# EasyEDA Pro project ProPrj_Piano_scan_for_conserts3_2026-02-26.epro, board reuse_base
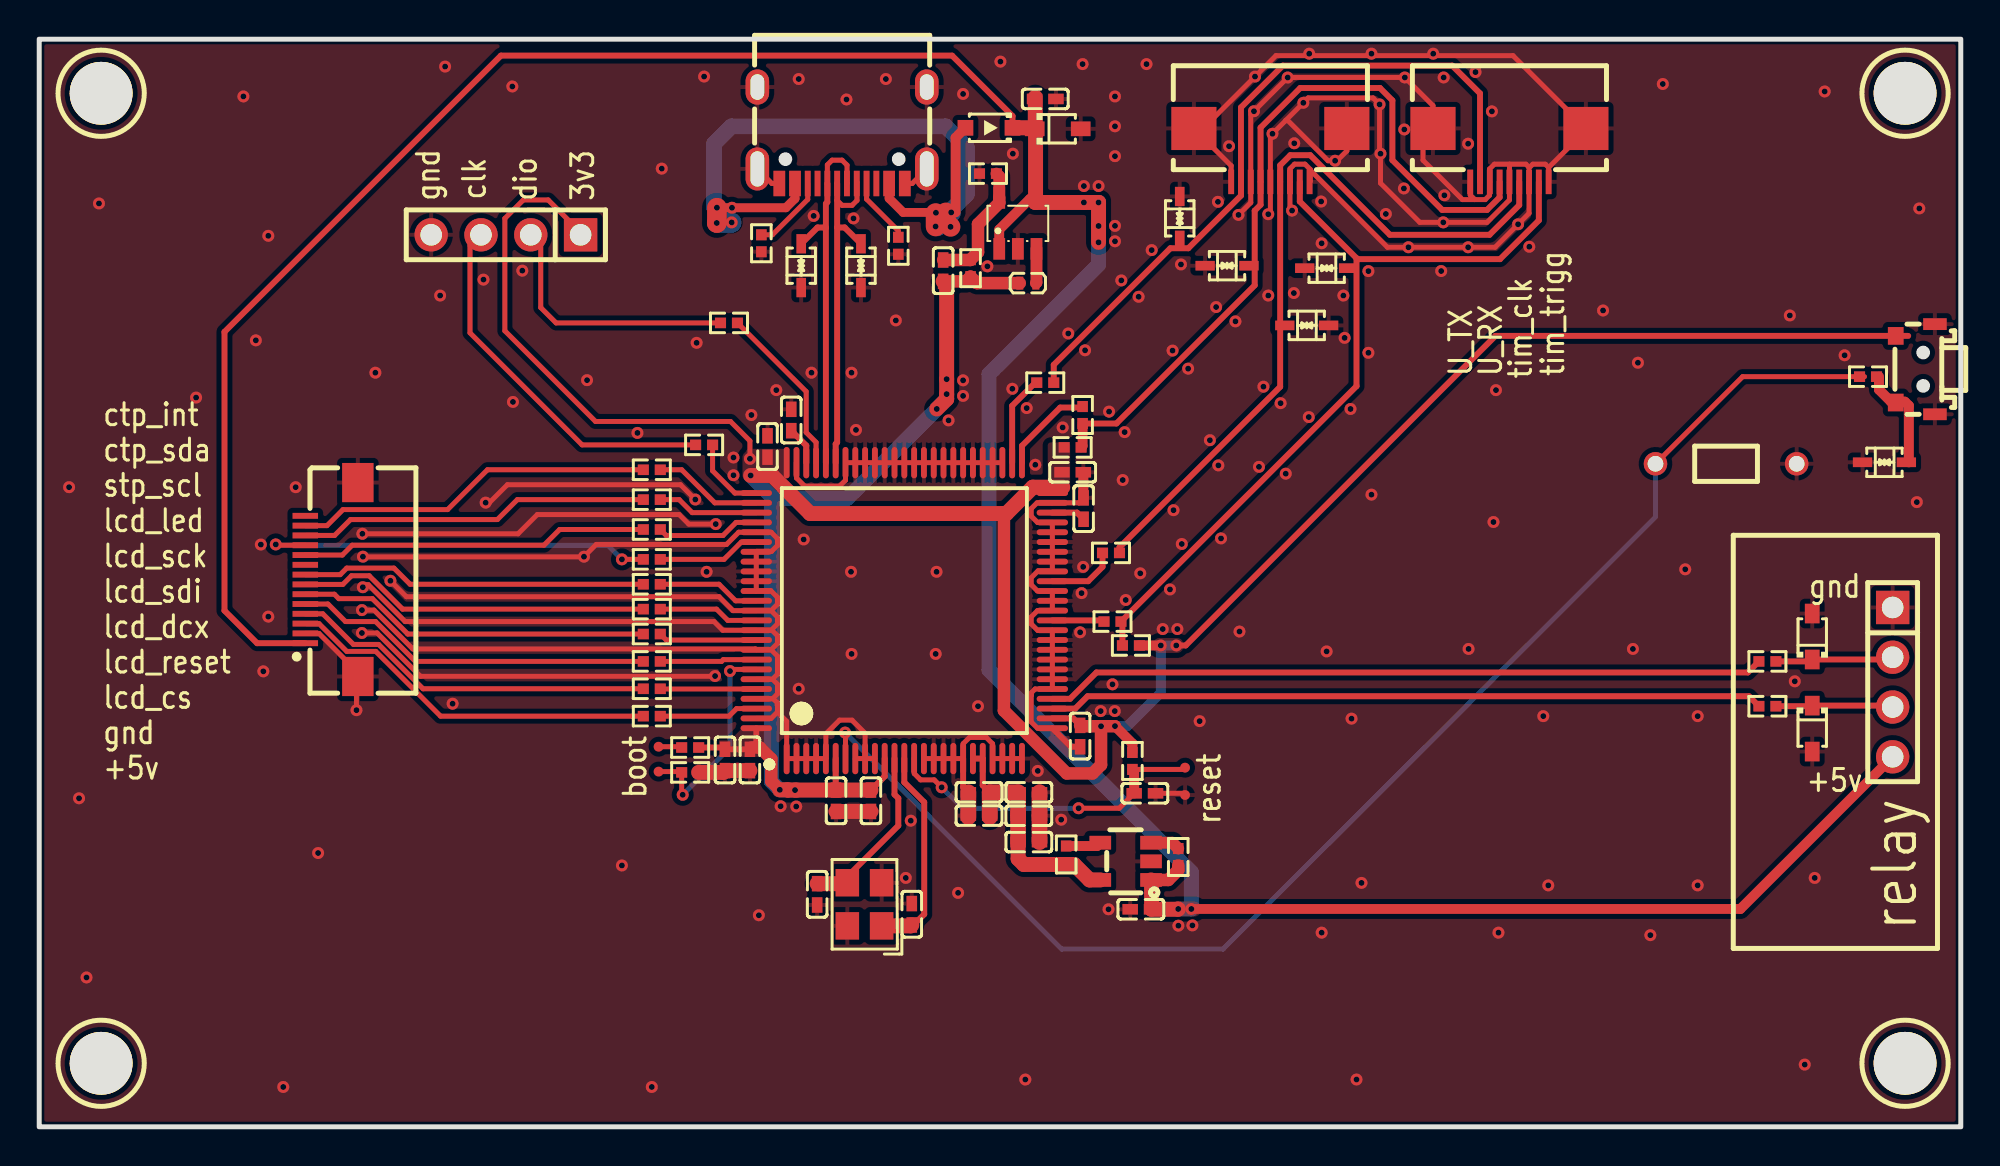
[diagram p8: board, top side]
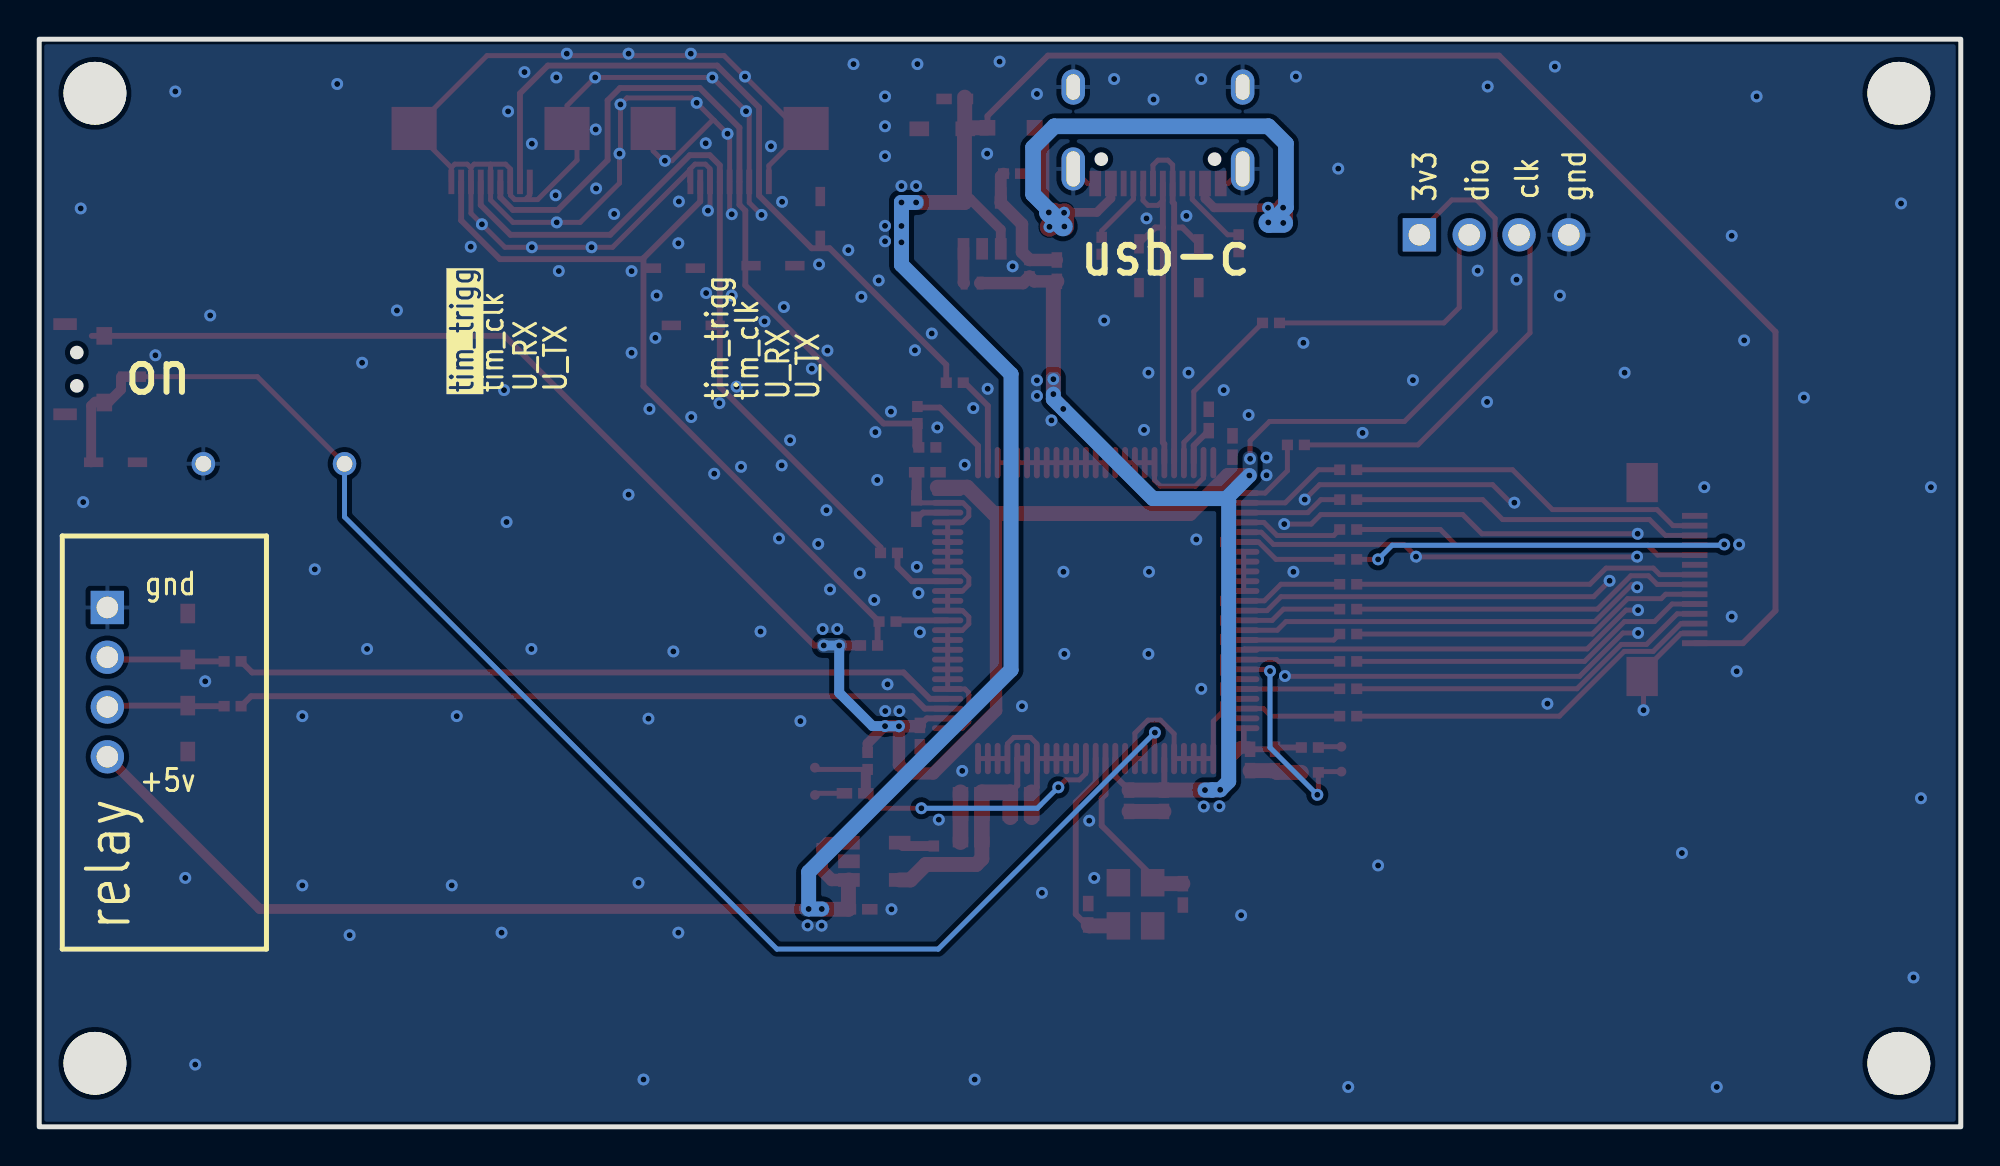
[diagram p9: board, bottom side, seen from below]

Outline 98 x 55.5 mm; copper layers: Top Layer, Bottom Layer. Coordinates in mm from the lower left corner of the outline.
Outline path: rectangle 0,55.5 98,0
Stack: Top Layer 0.035mm / Dielectric1 1.51mm FR4 er 4.5 / Bottom Layer 0.035mm

## Design rules (mm)
template: JLCPCB Capability(Two Layers Board)
spacing copperThickness1oz (default): track to track 0.102, other pairs 0.152 to 0.3
spacing copperThickness2oz: track to track 0.203, other pairs 0.152 to 0.3
track width copperThickness1oz (default): min 0.127, default 0.254, max 2.54
track width copperThickness2oz: min 0.203, default 0.254, max 2.54
differential pair differentialPair (default): width min 0.127, default 0.254, max 2.54; gap min 0.152, default 0.152
via viaSize (default): diameter min 0.5, default 0.61, max 10; hole min 0.3, default 0.305, max 6.3

## Placement (name value [footprint] x y rotation side)
C1  22pF  [C0402]  46.1 43.69 270 top
C2  1uF  [C0402]  56.19 11.1 180 top
C3  1uF  [C0402]  50.47 14.53 0 top
C4  10pF  [C0402]  39.68 11.86 90 top
C5  10pF  [C0402]  44.5 10.85 90 top
C6  100nF  [C0402]  40.64 16.64 90 top
C7  4.7uF  [C0402]  51.31 52.45 180 top
C8  1uF  [C0402]  50.47 17.07 0 top
C9  100nF  [C0402]  47.93 15.88 180 top
C10  1uF  [C0402]  50.47 15.87 0 top
C11  100nF  [C0402]  47.93 17.07 180 top
C12  2.2uF  [C0402]  38.35 36.07 270 top
C13  100nF  [C0402]  56.39 17.02 0 top
C14  2.2uF  [C0402]  53.26 31.55 90 top
C15  100nF  [C0402]  42.42 16.64 270 top
C16  100nF  [C0402]  36.25 18.72 270 top
C17  100nF  [C0402]  53.09 19.94 270 top
C18  100nF  [C0402]  52.7 33.4 0 top
C19  100nF  [C0402]  37.14 34.72 90 top
C20  10uF  [C0402]  34.98 18.72 270 top
D1  CDSOD323-T03C  [SOD-323_L1.8-W1.3-LS2.5-BI]  64.64 40.89 0 top
D2  CDSOD323-T03C  [SOD-323_L1.8-W1.3-LS2.5-BI]  60.58 43.94 180 top
D3  CDSOD323-T03C  [SOD-323_L1.8-W1.3-LS2.5-BI]  65.66 43.81 180 top
D4  CDSOD323-T03C  [SOD-323_L1.8-W1.3-LS2.5-BI]  58.17 46.36 90 top
D5  LESD3Z5.0T1G  [SOD-323_L1.8-W1.3-LS2.5-RD]  51.94 50.93 0 top
D6  B5819WS  [SOD-323_L1.7-W1.3-LS2.5-RD]  48.44 50.98 180 top
D7  LESD3Z5.0T1G  [SOD-323_L1.8-W1.3-LS2.5-RD]  90.42 25.02 90 top
D8  LESD3Z5.0T1G  [SOD-323_L1.8-W1.3-LS2.5-RD]  90.42 20.32 270 top
D9  CDSOD323-T05C  [SOD-323_L1.8-W1.3-LS2.5-BI]  41.91 43.94 270 top
D10  CDSOD323-T05C  [SOD-323_L1.8-W1.3-LS2.5-BI]  38.86 43.94 270 top
D11  CDSOD323-T03C  [SOD-323_L1.8-W1.3-LS2.5-BI]  94.11 33.91 0 top
H2  debug  [HDR-TH_4P-P2.54-V-M]  23.8 45.52 180 top
H3  relay  [HDR-TH_4P-P2.54-V-M]  94.53 22.69 270 top
L1  2.2uH  [IND-SMD_L1.2-W0.7]  50.42 43.05 180 top
R1  680kΩ  [R0402]  47.5 43.81 270 top
R2  150kΩ  [R0402]  48.39 48.64 0 top
R3  10kΩ  [R0402]  58.09 13.77 270 top
R4  100kΩ  [R0402]  52.38 13.89 270 top
R5  100Ω  [R0402]  31.24 20.95 180 top
R6  100Ω  [R0402]  31.24 22.35 180 top
R7  100Ω  [R0402]  31.24 23.75 180 top
R8  100Ω  [R0402]  31.24 25.15 180 top
R9  100Ω  [R0402]  31.24 26.42 180 top
R10  100Ω  [R0402]  31.24 27.69 180 top
R11  33Ω  [R0402]  35.18 41.02 180 top
R12  33Ω  [R0402]  33.91 34.8 180 top
R13  100Ω  [R0402]  31.24 28.96 180 top
R14  100Ω  [R0402]  31.24 30.48 180 top
R15  100Ω  [R0402]  31.24 32 180 top
R16  100Ω  [R0402]  31.24 33.53 180 top
R17  330Ω  [R0402]  33.2 19.36 180 top
R18  10kΩ  [R0402]  55.75 18.67 270 top
R19  10kΩ  [R0402]  33.2 18.09 180 top
R20  1kΩ  [R0402]  55.68 24.56 180 top
R21  5.1kΩ  [R0402]  43.81 44.96 90 top
R22  62Ω  [R0402]  54.74 25.78 180 top
R23  100Ω  [R0402]  54.66 29.29 180 top
R24  100Ω  [R0402]  88.14 23.75 180 top
R25  100Ω  [R0402]  88.14 21.46 180 top
R26  100Ω  [R0402]  51.31 37.97 0 top
R27  5.1kΩ  [R0402]  53.21 36.32 270 top
R28  62Ω  [R0402]  36.83 45.09 90 top
R29  1kΩ  [R0402]  52.71 34.67 0 top
R30  330Ω  [R0402]  93.27 38.28 180 top
R31  10kΩ  [RES-TH_BD1.8-L3.2-P7.20-D0.4]  86.03 33.83 180 top
SCREW1  -  [Screw-Hole-M3]  95.22 52.68 0 top
SCREW2  -  [Screw-Hole-M3]  3.22 3.18 0 top
SCREW3  -  [Screw-Hole-M3]  95.22 3.18 0 top
SCREW4  -  [Screw-Hole-M3]  3.22 52.68 0 top
SW1  1TS003BBB-2000-3503B-CT  [KEY-SMD_1TS003B]  95.68 38.66 90 top
TP1  -  [Test-Point-0.5mm]  31.59 19.4 180 top
TP2  -  [Test-Point-0.5mm]  58.44 18.33 90 top
TP3  -  [Test-Point-0.5mm]  31.59 18.13 180 top
TP4  -  [Test-Point-0.5mm]  58.44 16.93 90 top
U1  AFD01-S09FCA-00  [FPC-SMD_9P-P0.50_JS_AFD01-S09FCA-00]  62.79 49.58 0 top
U2  AFD01-S09FCA-00  [FPC-SMD_9P-P0.50_JS_AFD01-S09FCA-00]  74.98 49.58 0 top
U3  AFC01-S14FCA-00  [SOT-23-5_L3.0-W1.7-P0.95-LS2.8-BR]  49.91 46.1 270 top
U4  SY8088AAC  [TSOT-23-5_L2.9-W1.6-P0.95-LS2.8-BR]  55.41 13.55 0 top
U5  LDLN030G33R  [LQFP-100_L14.0-W14.0-P0.50-LS16.0-BL]  44.12 26.34 0 top
U6  STM32H723VGT6  [CRYSTAL-SMD_4P-L3.2-W2.5-BL-1]  42.09 11.35 90 top
USB1  U262-161N-4BVC11  [USB-3.1-SMD_U262-161N-4BVC11]  40.94 50.6 180 top
X1  AFC01-S14FCA-00  [FPC-SMD_AFC01-S14FCA-00]  14.91 27.93 90 top

## Footprints (pads in the part's own frame, mm; a bottom-side part is the same pattern mirrored in y, then rotated)
C0402
  rect 0.79x0.54 smd: 1(-0.545,0) 2(0.545,0)
CRYSTAL-SMD_4P-L3.2-W2.5-BL-1
  rect 1.4x1.2 smd: 1(-1.1,-0.875) 2(1.1,-0.875) 3(1.1,0.875) 4(-1.1,0.875)
FPC-SMD_9P-P0.50_JS_AFD01-S09FCA-00
  rect 0.3x1.25 smd: 1(-2,-1.363) 2(-1.5,-1.363) 3(-1,-1.363) 4(-0.5,-1.363) 5(0,-1.363) 6(0.499,-1.363) 7(1,-1.363) 8(1.5,-1.363) 9(2,-1.363)
  rect 2.3x2.2 smd: 10(3.9,1.363) 11(-3.9,1.363)
FPC-SMD_AFC01-S14FCA-00
  rect 0.3x1.3 smd: 1(-3.25,1.34) 2(-2.75,1.339) 3(-2.25,1.34) 4(-1.75,1.34) 5(-1.25,1.34) 6(-0.75,1.34) 7(-0.25,1.34) 8(0.25,1.34) 9(0.75,1.34) 10(1.25,1.34) 11(1.75,1.34) 12(2.25,1.34) 13(2.75,1.34) 14(3.25,1.34)
  rect 2x1.6 smd: 15(4.948,-1.34) 16(-4.948,-1.34)
HDR-TH_4P-P2.54-V-M
  rect 1.7x1.7 hole 1.1: 1(-3.81,0)
  round 1.7 hole 1.1: 2(-1.27,0) 3(1.27,0) 4(3.81,0)
IND-SMD_L1.2-W0.7
  rect 0.36x0.66 smd: 1(-0.41,0) 2(0.41,0)
KEY-SMD_1TS003B
  rect 0.9x0.8 smd: 1(1.7,1) 2(-1.7,1)
  rect 0.6x1.2 smd: 3(-2.3,-1) 4(2.3,-1)
LQFP-100_L14.0-W14.0-P0.50-LS16.0-BL
  oval 0.3x1.6 smd: 1(-6,-7.55) 2(-5.5,-7.55) 3(-5,-7.55) 4(-4.5,-7.55) 5(-4,-7.55) 6(-3.5,-7.55) 7(-3,-7.55) 8(-2.5,-7.55) 9(-2,-7.55) 10(-1.5,-7.55) 11(-1,-7.55) 12(-0.5,-7.55) 13(0,-7.55) 14(0.5,-7.55) 15(1,-7.55) 16(1.5,-7.55) 17(2,-7.55) 18(2.5,-7.55) 19(3,-7.55) 20(3.5,-7.55) 21(4,-7.55) 22(4.5,-7.55) 23(5,-7.55) 24(5.5,-7.55) 25(6,-7.55) 51(6,7.55) 52(5.5,7.55) 53(5,7.55) 54(4.5,7.55) 55(4,7.55) 56(3.5,7.55) 57(3,7.55) 58(2.5,7.55) 59(2,7.55) 60(1.5,7.55) 61(1,7.55) 62(0.5,7.55) 63(0,7.55) 64(-0.5,7.55) 65(-1,7.55) 66(-1.5,7.55) 67(-2,7.55) 68(-2.5,7.55) 69(-3,7.55) 70(-3.5,7.55) 71(-4,7.55) 72(-4.5,7.55) 73(-5,7.55) 74(-5.5,7.55) 75(-6,7.55)
  oval 1.6x0.3 smd: 26(7.55,-6) 27(7.55,-5.5) 28(7.55,-5) 29(7.55,-4.5) 30(7.55,-4) 31(7.55,-3.5) 32(7.55,-3) 33(7.55,-2.5) 34(7.55,-2) 35(7.55,-1.5) 36(7.55,-1) 37(7.55,-0.5) 38(7.55,0) 39(7.55,0.5) 40(7.55,1) 41(7.55,1.5) 42(7.55,2) 43(7.55,2.5) 44(7.55,3) 45(7.55,3.5) 46(7.55,4) 47(7.55,4.5) 48(7.55,5) 49(7.55,5.5) 50(7.55,6) 76(-7.55,6) 77(-7.55,5.5) 78(-7.55,5) 79(-7.55,4.5) 80(-7.55,4) 81(-7.55,3.5) 82(-7.55,3) 83(-7.55,2.5) 84(-7.55,2) 85(-7.55,1.5) 86(-7.55,1) 87(-7.55,0.5) 88(-7.55,0) 89(-7.55,-0.5) 90(-7.55,-1) 91(-7.55,-1.5) 92(-7.55,-2) 93(-7.55,-2.5) 94(-7.55,-3) 95(-7.55,-3.5) 96(-7.55,-4) 97(-7.55,-4.5) 98(-7.55,-5) 99(-7.55,-5.5) 100(-7.55,-6)
R0402
  rect 0.566x0.54 smd: 1(-0.433,0) 2(0.433,0)
RES-TH_BD1.8-L3.2-P7.20-D0.4
  round 1.2 hole 0.8: 1(-3.6,0) 2(3.6,0)
Screw-Hole-M3
  round 3.2 hole 3.2: 1(-0.064,0.064)
SOD-323_L1.7-W1.3-LS2.5-RD
  rect 0.8x0.8 smd: 1(-1.2,0) 2(1.2,0)
SOD-323_L1.8-W1.3-LS2.5-BI
  rect 0.985x0.49 smd: 1(-1.117,0) 2(1.117,0)
SOD-323_L1.8-W1.3-LS2.5-RD
  rect 1x0.75 smd: 1(-1.173,0) 2(1.173,0)
SOT-23-5_L3.0-W1.7-P0.95-LS2.8-BR
  rect 1.1x0.6 smd: 1(1.3,-0.95) 2(1.3,0) 3(1.3,0.95) 4(-1.3,0.95) 5(-1.3,-0.95)
Test-Point-0.5mm
  round 0.5 smd: 1(0,0)
TSOT-23-5_L2.9-W1.6-P0.95-LS2.8-BR
  rect 1.1x0.7 smd: 1(1.294,-0.951) 2(1.294,-0.001) 3(1.294,0.951) 4(-1.294,0.951) 5(-1.294,-0.949)
USB-3.1-SMD_U262-161N-4BVC11
  oval 1.2x2.2 hole 0.7x1.8: 13(4.32,1.719) 16(-4.32,1.719)
  oval 1.2x1.8 hole 0.7x1.3: 14(4.32,-2.462) 15(-4.32,-2.462)
  rect 0.6x1.3 smd: A1B12(-3.2,2.462) A4B9(-2.4,2.462) B1A12(3.2,2.462) B4A9(2.4,2.462)
  rect 0.3x1.3 smd: A5(-1.25,2.462) A6(-0.25,2.462) A7(0.25,2.462) A8(1.25,2.462) B5(1.75,2.462) B6(0.75,2.462) B7(-0.75,2.462) B8(-1.75,2.462)

## Nets
+3V3: C1.2 C6.2 C15.1 C16.1 C17.1 C18.1 C19.1 C20.1 H2.1 L1.2 R1.2 R17.1 R18.1 R20.1 R29.1 SW1.1 U5.6 U5.11 U5.27 U5.50 U5.75 U5.100
+5V: C2.1 C7.2 D5.1 D6.1 H3.4 R3.2 U3.1 U3.4 U4.1 X1.1
GND: C2.2 C3.2 C4.1 C5.2 C6.1 C7.1 C8.2 C9.2 C10.2 C11.2 C12.1 C13.2 C14.2 C15.2 C16.2 C17.2 C18.2 C19.2 C20.2 D1.2 D2.2 D3.2 D4.2 D5.2 D7.2 D8.2 D9.2 D10.2 D11.1 H2.4 H3.1 R2.1 R19.1 R21.1 R28.1 R31.1 SW1.3 SW1.4 TP4.1 U1.1 U1.3 U1.5 U1.7 U1.9 U1.10 U1.11 U2.1 U2.3 U2.5 U2.7 U2.9 U2.10 U2.11 U3.2 U4.2 U5.1 U5.2 U5.3 U5.4 U5.5 U5.8 U5.9 U5.10 U5.15 U5.16 U5.17 U5.18 U5.19 U5.22 U5.23 U5.24 U5.25 U5.26 U5.30 U5.31 U5.32 U5.33 U5.34 U5.35 U5.36 U5.38 U5.39 U5.40 U5.42 U5.43 U5.44 U5.45 U5.46 U5.47 U5.49 U5.53 U5.54 U5.55 U5.56 U5.57 U5.58 U5.59 U5.60 U5.61 U5.62 U5.63 U5.64 U5.65 U5.66 U5.67 U5.68 U5.69 U5.74 U5.80 U5.82 U5.83 U5.84 U5.85 U5.86 U5.88 U5.90 U5.92 U5.95 U5.97 U5.99 U6.2 U6.4 USB1.13 USB1.14 USB1.15 USB1.16 USB1.A1B12 USB1.B1A12 X1.2 X1.15 X1.16
VBUS: D6.2 USB1.A4B9 USB1.B4A9
VDDA: C3.1 C8.1 C9.1 C10.1 C11.1 R4.2 U4.5 U5.20 U5.21
BOOT0: R19.2 TP3.1 U5.94
CTP_INT: R16.2 X1.13
CTP_RST: R13.2 X1.11
CTP_SCL: R14.2 X1.10
CTP_SDA: R15.2 X1.12
LCD_CS: R5.2 X1.3
LCD_DCX: R7.2 X1.5
LCD_LED: R10.2 X1.8
LCD_RESET: R6.2 X1.4
LCD_SCK: R9.2 X1.7
LCD_SDI: R8.2 X1.6
RCC_OSC_IN: C4.2 U5.12 U6.3
RCC_OSC_OUT: C5.1 U5.13 U6.1
RELAY_1: R25.2 U5.28
RELAY_2: R24.2 U5.29
RESET: C13.1 R18.2 TP2.1 U5.14
SYS_ITCK-SWCLK: R12.1 U5.76
SYS_ITMS-SWDIO: R11.1 U5.72
TIM_CLK: D1.1 R23.1 U1.6 U2.6
TIM_TRIGG: D3.1 R20.2 R22.1 U1.8 U2.8
U_RX: D2.1 R27.2 R29.2 U1.4 U2.4
U_TX: D4.1 R26.2 U1.2 U2.2
USB_DN: D9.1 U5.70 USB1.A7 USB1.B7
USB_DP: D10.1 U5.71 USB1.A6 USB1.B6
WAKEUP: R30.2 R31.2 U5.7
$1N5495: R4.1 U4.4
$1N5501: R3.1 U4.3
$1N5509: C14.1 U5.48
$1N5515: C12.2 U5.73
$1N5531: R22.2 U5.37
$1N5532: D8.1 H3.3 R25.1
$1N5535: D7.1 H3.2 R24.1
$1N5542: D11.2 R30.1 SW1.2
$1N5554: H2.3 R12.2
$1N5555: H2.2 R11.2
$1N5563: R17.2 TP1.1
$1N5587: R28.2 USB1.B5
$1N5590: R21.2 USB1.A5
$1N5866: R23.2 U5.41
$1N5914: R27.1 U5.51
$1N6033: R26.1 U5.52
$1N6271: R5.1 U5.98
$1N6331: R6.1 U5.96
$1N6370: R7.1 U5.93
$1N6416: R8.1 U5.91
$1N6457: R9.1 U5.89
$1N6507: R10.1 U5.87
$1N6551: R13.1 U5.81
$1N6676: R14.1 U5.79
$1N6680: R15.1 U5.78
$1N6685: R16.1 U5.77
$1N6938: L1.1 U3.3
$1N7163: C1.1 R1.1 R2.2 U3.5

Pads without a net: SCREW1 1; SCREW2 1; SCREW3 1; SCREW4 1; USB1 A8 B8; X1 9 14

## Via types
v1: diameter 0.61, hole 0.305, Top Layer to Bottom Layer, 231 vias

## Routing (per net, layer and track width the routed paths; a pad name or vN(x,y) marks a point on that pad's centre or on a via; arc(x,y) is an arc through that point)
+3V3: length 174
  Top Layer w0.254: v1(36.25,34.09) 36.25,35 35.25,35.99 28.37,35.99 23.75,40.62 23.75,46.36 24.69,47.3 25.96,47.3 27.61,45.64 H2.1
  Top Layer w0.299: 95.32,40.36 74.27,40.36 58.47,24.56 v1(57.99,24.56)
  Top Layer w0.3: U5.100 36.57,19.59 36.34,19.36 ; C16.1 C20.1 34.89,19.36 R17.1
  Top Layer w0.305: C17.1 52.73,20.84 U5.27 ; C15.1 43.12,17.89 43.12,18.79 ; 40.62,17.2 40.62,18.79
  Top Layer w0.508: R18.1 55.75,19.56 v1(54.86,20.45) ; v1(57.2,24.56) R20.1 ; 36.34,19.36 C16.1
  Top Layer w0.635: C17.1 53.13,20.44 v1(54.15,20.44) ; 49.14,31.29 49.14,31.17 49.2,31.11 49.2,21.24 52.4,18.03 53.72,18.03 54.15,18.47 v1(54.15,20.44) ; L1.2 47.83,43.05 R1.2 47.26,43.14 C1.2 ; v1(37.77,17.2) 37.34,17.63 37.34,18.77 36.75,19.36 36.34,19.36 ; v1(54.15,20.44) 54.86,20.44 ; 38.66,17.2 38.65,17.18
  Top Layer w0.762: C15.1 C6.2 v1(38.55,17.18) 38.18,17.18 38.17,17.2 v1(37.77,17.2) ; v1(45.78,36.63) 46.28,37.14 v1(46.28,37.39) v1(46.28,38.15) 46.28,42.97 C1.2 ; 52.2,32.64 50.67,32.64 49.33,31.29 39.32,31.29 37.38,33.24 v1(36.28,33.24)
  Bottom Layer w0.508: v1(54.15,20.44) 54.86,20.44 v1(54.86,20.45) 55.5,20.45 57.2,22.15 v1(57.2,24.56) v1(57.99,24.56)
  Bottom Layer w0.762: v1(46.28,37.39) 46.28,37.14 v1(45.78,36.63) 41.2,32.06 37.46,32.06 ; v1(36.28,33.24) 37.46,32.06 ; 37.46,32.06 37.34,31.93 37.34,17.63 v1(37.77,17.2) 38.17,17.2 38.18,17.18 v1(38.55,17.18)
+5V: length 170.1
  Top Layer w0.3: X1.1 11.11,24.68 9.45,26.34 9.45,40.56 23.55,54.66 46.56,54.66 49.64,51.58 D6.1
  Top Layer w0.5: H3.4 86.76,11.12 v1(58.76,11.12) ; U3.1 48.96,45.79 50.53,47.35 50.81,47.35
  Top Layer w0.635: 58.09,13.33 58.09,13.1 57.58,12.6 U4.1
  Top Layer w0.762: U4.1 56.73,12.57 C2.1 58.07,11.1 v1(58.09,11.12) ; 50.8,50.98 50.8,52.54 ; 50.8,50.98 50.8,50.96 D5.1 ; 50.8,50.98 D6.1 ; 50.8,50.98 50.81,50.98 50.81,47.22 50.79,47.19 50.81,47.17 v1(53.28,47.17) v1(54.03,47.17) v1(54.03,45.97) v1(54.03,45.13)
  Bottom Layer w0.762: v1(58.09,11.12) v1(58.76,11.12) 58.76,13 48.44,23.32 48.44,38.41 54.03,43.99 v1(54.03,45.13) v1(54.03,45.97) v1(54.03,47.17) v1(53.28,47.17)
GND: length 328.2
  Top Layer w0.254: C13.2 58.35,17.02 TP4.1 ; 64.82,48.82 64.82,48.86 64.55,49.12 64.02,49.12 63.79,48.89 U1.7 63.79,46.86 v1(63.9,46.75) ; 64.82,48.82 64.82,48.25 U1.9 ; 64.82,48.82 68.76,44.88 v1(69.83,44.88) v1(72.88,44.88) 74.25,44.88 v1(75.42,46.06) 75.98,46.61 U2.7 ; 50.12,18.79 48.62,18.79 48.62,19.55 48.3,19.87 47.44,19.87 47.12,19.55 47.12,18.79 45.12,18.79 ; v1(16.46,26.37) 17.07,26.37 19.05,24.38 36.53,24.38 U5.92 ; 74.98,49.12 74.98,48.22 U2.5 74.98,47.3 73.84,46.15 v1(71.61,46.15) 70.41,46.15 68.41,48.16 v1(68.41,49.66) 68.36,49.71 v1(68.36,52.17) 68.03,52.5 64.72,52.5 v1(64.47,52.25) 63.58,51.36 63.58,51.36 ; 74.98,49.12 74.22,49.12 73.97,48.87 73.97,48.2 ; 74.98,49.12 75.82,49.12 75.98,48.96 75.98,48.93 76.17,49.12 76.81,49.12 76.98,48.95 ; U5.53 U5.54 U5.55 U5.56 U5.57 U5.58 U5.59 U5.60 U5.61 U5.62 U5.63 U5.64 U5.65 U5.66 U5.67 U5.68 U5.69 41.12,32.99 40.82,32.69 39.04,32.69 38.62,33.11 U5.74 ; 73.22,47.31 73.75,47.31 73.97,47.53 73.97,48.2 ; 73.22,47.31 72.58,47.31 70.57,49.32 70.57,50.44 U2.11 71.08,52.11 v1(69.65,53.55) 63.99,53.55 63.99,53.54 v1(63.67,53.54) v1(61.95,51.82) 61.79,51.66 U1.3 61.79,47.16 v1(61.16,46.53) ; 73.22,47.31 72.98,47.55 U2.1 ; C14.2 53.01,31.84 U5.49 50.89,31.84 50.59,31.54 50.59,31.16 50.91,30.84 U5.47 U5.46 U5.45 U5.44 U5.43 U5.42 51.64,28.37 50.94,28.37 50.59,28.02 50.59,27.66 50.91,27.34 U5.40 U5.39 U5.38 50.91,26.34 50.59,26.02 50.59,25.66 50.93,25.32 51.65,25.32 U5.36 U5.35 U5.34 U5.33 U5.32 U5.31 U5.30 50.79,22.34 50.6,22.15 50.6,22.02 50.59,22.02 50.59,20.66 50.91,20.34 U5.26 ; 36.62,48.88 37.37,48.14 USB1.B1A12 ; 37.4,21.84 37.44,21.84 37.64,21.64 37.64,21.52 37.65,21.52 37.65,21.16 ; 37.4,21.84 37.65,22.09 37.65,22.59 37.4,22.84 ; 37.4,21.84 U5.97 ; v1(16.51,29.09) 16.52,29.08 27.77,29.08 v1(27.78,29.09) 28.41,29.72 35.05,29.72 35.67,30.34 U5.80 37.33,30.34 37.65,30.02 37.65,29.66 37.35,29.36 36.59,29.36 U5.82 U5.83 U5.84 U5.85 U5.86 36.59,27.36 37.31,27.36 37.65,27.02 37.65,26.66 37.33,26.34 ; v1(16.5,27.53) 16.63,27.66 16.78,27.66 18.66,25.78 34.42,25.78 34.86,25.34 U5.90 ; 37.33,24.34 37.65,24.66 37.65,25.06 37.37,25.34 37.33,25.34 37.65,25.66 37.65,26.02 37.33,26.34 ; v1(16.46,25.2) 17.23,25.2 19.44,22.99 34.45,22.99 v1(34.47,23) ; v1(34.5,30.76) 33.12,30.76 32.64,31.24 25.4,31.24 24.42,30.26 v1(16.48,30.26) ; 73.97,48.2 U2.3 ; v1(62.68,46.57) 62.79,46.68 U1.5 62.79,50.57 v1(62.9,50.67) 63.58,51.36 ; 63.58,51.36 63.67,51.36 65.73,49.3 v1(66.09,49.3) 66.19,49.3 66.69,49.8 U1.10 ; 37.4,22.84 37.65,23.09 37.65,24.02 37.33,24.34 ; 37.4,22.84 U5.95 ; v1(22.77,31.85) 22.96,31.85 23.88,32.77 32.7,32.77 v1(33.46,32.01) ; U1.1 60.79,49.04 U1.11 59.36,50.94 v1(62.01,53.59) 63.07,54.66 75.16,54.66 U2.10 78.88,50.85 76.98,48.95 ; 76.98,48.95 U2.9 ; 42.12,18.79 41.62,18.79 ; 42.12,18.79 42.62,18.79 ; 42.12,18.79 42.12,20.09 41.45,20.75 40.82,20.75 40.12,20.05 40.12,18.79 38.12,18.79 38.12,20.69 37.65,21.16 ; v1(16.18,21.26) 16.18,23.26 14.26,25.18 X1.2 ; 37.65,21.16 37.33,20.84 U5.99 ; v1(17.91,27.86) 18.72,27.05 34.67,27.05 35.38,26.34 U5.88 ; USB1.A1B12 44.52,48.14 45.26,48.88
  Top Layer w0.3: 47.38,17.07 47.12,17.33 47.12,18.79
  Top Layer w0.305: U5.26 52.62,19.39 C17.2
  Top Layer w0.508: C14.2 53.25,32.11 C18.2
  Top Layer w0.762: R19.1 34.89,18.09 C20.2 C16.2 ; C6.1 C15.2
  Top Layer w0.8: C3.2 C8.2 ; 47.38,17.07 47.38,15.8
  vias: v1(1.52,32.64) v1(2.03,16.76) v1(2.41,7.62) v1(3.05,47.12) v1(8,37.21) v1(10.41,52.58) v1(11.05,40.13) v1(11.3,29.71) v1(11.43,23.24) v1(11.68,45.47) v1(11.68,26.04) v1(12.45,2.03) v1(13.08,32.64) v1(14.22,13.97) v1(17.14,38.48) v1(20.45,42.42) v1(20.7,54.1) v1(21.08,21.59) v1(22.66,43.23) v1(24.13,53.09) v1(24.16,36.99) v1(24.64,43.69) v1(27.94,38.1) v1(29.72,13.34) v1(30.51,35.41) v1(31.24,2.03) v1(31.75,48.9) v1(33.53,40.01) v1(33.91,53.59) v1(34.04,28.32) v1(35.41,34.15) v1(35.41,33.25) v1(36.32,36.32) v1(36.7,10.8) v1(37.59,37.59) v1(37.81,16.36) v1(38.61,16.34) v1(38.73,53.47) v1(38.73,22.35) v1(38.99,29.97) v1(39.39,38.48) v1(39.5,46.48) v1(41.17,52.42) v1(41.43,38.48) v1(41.4,28.32) v1(41.43,24.13) v1(41.53,46.36) v1(41.66,35.56) v1(43.18,53.47) v1(43.69,41.15) v1(44.2,12.7) v1(44.45,15.62) v1(45.72,24.13) v1(45.76,28.32) v1(46.38,36.05) v1(46.86,11.94) v1(47.12,52.71) v1(47.12,38.09) v1(47.12,37.3) v1(47.88,21.46) v1(48.36,43.91) v1(49.02,54.36) v1(49.63,37.66) v1(49.66,49.66) v1(50.29,2.41) v1(50.36,36.68) v1(50.8,33.78) v1(50.93,18.16) v1(52.12,15.67) v1(52.2,35.69) v1(52.48,40.48) v1(53.09,25.23) v1(53.21,54.23) v1(53.24,28.57) v1(53.16,27.23) v1(53.28,48.01) v1(53.34,39.62) v1(54.03,48.01) v1(54.13,21.21) v1(54.53,11.1) v1(54.56,36.5) v1(54.74,22.58) v1(54.86,52.58) v1(54.86,51.05) v1(54.86,49.53) v1(54.86,45.97) v1(54.86,45.19) v1(54.85,21.21) v1(55.19,43.19) v1(55.26,33) v1(55.36,35.45) v1(55.41,26.88) v1(56.07,42.36) v1(56.15,28.24) v1(56.47,54.23) v1(56.74,44.74) v1(57.3,25.4) v1(57.67,27.42) v1(57.8,39.61) v1(57.85,31.47) v1(58.04,25.4) v1(58.1,10.26) v1(58.23,44.01) v1(58.27,29.74) v1(58.59,38.69) v1(58.81,10.28) v1(59.18,20.7) v1(59.71,35.04) v1(60.02,41.83) v1(60.11,47.2) v1(60.14,33.75) v1(60.27,30.03) v1(60.68,50.04) v1(61.01,41.1) v1(61.21,25.27) v1(62.21,33.68) v1(62.44,37.77) v1(62.68,42.42) v1(63.31,36.93) v1(63.57,33.33) v1(64.01,50.19) v1(63.99,42.55) v1(64.75,36.22) v1(64.77,54.76) v1(65.38,47.22) v1(65.4,45.09) v1(65.4,9.91) v1(65.66,24.26) v1(66.51,42.42) v1(66.58,40.26) v1(66.88,36.63) v1(66.93,20.83) v1(67.18,2.41) v1(67.44,12.45) v1(67.79,43.67) v1(67.79,39.5) v1(67.94,54.76) v1(67.94,32.26) v1(68.68,46.58) v1(69.62,50.89) v1(69.6,47.88) v1(71.09,54.76) v1(71.5,43.67) v1(71.63,53.55) v1(71.66,47.53) v1(72.87,50.17) v1(72.9,24.38) v1(73.25,53.82) v1(74.09,51.82) v1(74.17,30.86) v1(74.29,37.59) v1(74.42,9.91) v1(75.99,44.91) v1(76.71,20.96) v1(76.96,12.32) v1(79.76,41.66) v1(81.28,24.38) v1(81.53,38.99) v1(82.17,9.78) v1(82.8,53.21) v1(83.95,28.45) v1(84.58,20.96) v1(84.58,12.32) v1(89.28,41.4) v1(89.53,22.73) v1(90.04,3.18) v1(90.55,12.7) v1(91.06,52.83) v1(92.07,39.37) v1(95.76,31.88) v1(95.88,46.86)
VBUS: length 39.2
  Top Layer w0.45: v1(34.56,46.9) 35.32,46.9 v1(35.33,46.9) 38.08,46.9 38.54,47.36 USB1.B4A9 ; USB1.A4B9 43.34,47.38 44.06,46.66 46.24,46.66
  Top Layer w0.5: D6.2 46.74,50.48 46.74,46.66
  Top Layer w1: v1(46.48,45.92) 46.24,46.16 46.24,46.66 ; v1(45.72,45.94) 45.72,46.63 ; v1(34.56,46.12) 34.56,46.13 v1(34.56,46.9)
  Bottom Layer w0.8: v1(46.51,46.66) 46.51,46.79 47.31,47.59 47.31,49.97 46.23,51.05 35.31,51.05 34.42,50.17 34.42,46.92 35.19,46.15
  Bottom Layer w1: v1(35.32,46.15) 35.29,46.12 v1(34.56,46.12) ; 45.79,45.94 v1(46.51,46.66)
  vias: v1(45.73,46.64)
VDDA: length 13.1
  Top Layer w0.305: C11.1 48.12,17.42 48.12,18.79 47.62,18.79
  Top Layer w0.762: C3.1 49.93,13.68 50.22,13.39 52.78,13.39 53.57,12.6 U4.5
  Top Layer w0.8: 48.47,15.8 C11.1 C8.1 C3.1
(no net): length 0.7
  Bottom Layer w0.254: 94.68,2.76 SCREW3.1
BOOT0: length 11
  Top Layer w0.254: U5.94 35.31,23.34 v1(35.23,23.26) ; v1(32.82,16.94) 32.76,16.99 32.76,18.09 32.72,18.13 TP3.1
  Bottom Layer w0.254: v1(35.23,23.26) 35.23,19.36 v1(32.82,16.94)
CTP_INT: length 18.4
  Top Layer w0.254: R16.2 22.86,33.53 20.83,31.5 15.49,31.5 14.68,30.68 X1.13
CTP_RST: length 20.6
  Top Layer w0.254: X1.11 12.06,29.68 v1(12.06,29.72) ; v1(29.72,28.96) R13.2
  Bottom Layer w0.254: v1(29.72,28.96) 29,29.68 12.11,29.68 v1(12.06,29.72)
CTP_SCL: length 17.8
  Top Layer w0.254: X1.10 15.46,29.18 15.96,29.68 25.74,29.68 26.54,30.48 R14.2
CTP_SDA: length 18
  Top Layer w0.254: X1.12 15.06,30.18 15.88,30.99 23.37,30.99 24.38,32 R15.2
LCD_CS: length 19.2
  Top Layer w0.254: X1.3 14.27,25.68 15.69,24.26 17.17,24.26 20.47,20.95 R5.2
LCD_DCX: length 18.5
  Top Layer w0.254: X1.5 14.72,26.68 15.62,25.78 17.15,25.78 19.19,23.75 R7.2
LCD_LED: length 17.7
  Top Layer w0.254: X1.8 15.35,28.18 15.68,28.51 18.09,28.51 18.91,27.69 R10.2
LCD_RESET: length 18.8
  Top Layer w0.254: X1.4 14.46,26.18 16.03,24.61 17.31,24.61 19.58,22.35 R6.2
LCD_SCK: length 18.1
  Top Layer w0.254: X1.7 15.49,27.68 15.93,28.12 16.83,28.12 18.53,26.42 R9.2
LCD_SDI: length 18.1
  Top Layer w0.254: X1.6 15.05,27.18 15.28,26.95 16.99,26.95 18.8,25.15 R8.2
RCC_OSC_IN: length 9.1
  Top Layer w0.3: U6.3 41.21,12.77 43.81,15.37 43.81,16.76 43.62,16.96 43.62,18.79
  Top Layer w0.762: C4.2 41.17,12.41 U6.3
RCC_OSC_OUT: length 10.7
  Top Layer w0.3: 44.59,10.3 45.14,10.85 45.14,16.56 44.12,17.58 44.12,18.79
  Top Layer w0.762: C5.1 44.45,10.25 U6.1
RELAY_1: length 36.5
  Top Layer w0.3: U5.28 52.84,21.34 53.47,21.97 87.2,21.97 R25.2
RELAY_2: length 36.8
  Top Layer w0.3: R24.2 87.14,23.19 53.92,23.19 52.57,21.84 U5.29
RESET: length 17
  Top Layer w0.254: TP2.1 58.35,18.24 R18.2 ; 44.62,18.79 44.63,18.78 44.63,18.03 44.95,17.7 45.64,17.7 v1(46.03,17.32) ; v1(53.01,16.26) 55.08,16.26 C13.1
  Top Layer w0.508: R18.2 55.84,18.15 C13.1
  Bottom Layer w0.254: v1(53.01,16.26) 47.09,16.26 v1(46.03,17.32)
SYS_ITCK-SWCLK: length 4
  Top Layer w0.254: U5.76 35.48,32.34 34.34,33.48 R12.1
SYS_ITMS-SWDIO: length 8.8
  Top Layer w0.254: U5.72 39.62,34.93 39.12,35.43 39.12,37.52 R11.1
TIM_CLK: length 39.1
  Top Layer w0.3: R23.1 55.09,29.57 63.29,37.76 U1.6 63.29,49.07 63.81,49.58 64.82,49.58 68.88,45.52 73.97,45.52 75.48,47.03 U2.6
TIM_TRIGG: length 41.9
  Top Layer w0.299: 55.22,25.83 55.24,25.81 R20.2
  Top Layer w0.3: 67.18,44.32 67.23,44.28 74.5,44.28 76.48,46.26 U2.8 ; 67.18,44.32 67.18,37.79 55.22,25.83 ; 67.18,44.32 64.29,47.22 U1.8
U_RX: length 39.6
  Top Layer w0.299: U1.4 62.29,47.05 61.99,46.75 61.99,42.94 54.94,35.89 R27.2
  Top Layer w0.3: U1.4 62.29,50.99 64.31,53.01 68.38,53.01 69.01,52.38 69.01,49.33 71.55,46.79 73.84,46.79 74.48,47.43 U2.4
  Top Layer w0.5: R27.2 53.21,34.75 R29.2
U_TX: length 36.7
  Top Layer w0.3: R26.2 51.74,38.88 57.69,44.83 58.6,44.83 61.29,47.52 U1.2 61.29,52.02 63.42,54.15 72.06,54.15 73.48,52.73 U2.2
USB_DN: length 18.1
  Top Layer w0.254: 41.7,48.21 41.71,48.2 41.71,47.27 41.46,47.02 40.95,47.02 40.69,47.27 40.7,47.28 ; 40.7,48.14 USB1.A7 ; 40.7,48.14 40.7,48.14 ; 40.7,48.14 40.7,48.21
  Top Layer w0.3: U5.70 40.62,34.85 40.69,34.92 USB1.A7
  Top Layer w0.305: D9.1 41.08,45.89 40.71,45.89 40.69,45.9
USB_DP: length 19
  Top Layer w0.254: USB1.B6 40.19,49.09 40.44,49.33 40.94,49.33 41.2,49.07 41.2,48.14 USB1.A6
  Top Layer w0.3: USB1.B6 40.19,47.18 40.12,47.11 U5.71
  Top Layer w0.305: D10.1 39.69,45.89 40.1,45.89 40.12,45.87
WAKEUP: length 71.6
  Top Layer w0.254: R31.2 86.88,38.28 93.09,38.28 ; 41.12,18.79 41.12,20.1 v1(41.1,20.12)
  Bottom Layer w0.254: R31.2 82.43,31.12 60.38,9.07 52.15,9.07 v1(41.1,20.12)
$1N5495: length 1.8
  Top Layer w0.508: R4.1 53.94,14.33 U4.4
$1N5501: length 1.5
  Top Layer w0.6: R3.1 57.79,14.5 U4.3
$1N5509: length 1.7
  Top Layer w0.305: C14.1 52.93,31.34 U5.48
$1N5515: length 2
  Top Layer w0.305: C12.2 38.47,35.4 38.48,35.4 39.12,34.76 U5.73
$1N5531: length 2.7
  Top Layer w0.3: U5.37 54.35,25.84 54.35,25.83
$1N5532: length 6
  Top Layer w0.299: R25.1 90.39,21.46 D8.1 94.45,21.49 H3.3
$1N5535: length 6
  Top Layer w0.299: R24.1 90.33,23.75 D7.1 94.41,23.85 H3.2
$1N5542: length 5.3
  Top Layer w0.508: 95.19,36.96 95.35,36.8 95.35,33.91 ; 95.14,37.01 94.44,37.01 93.83,37.62 93.83,38.28
$1N5554: length 19.1
  Top Layer w0.254: H2.3 21.97,44.96 21.97,40.51 27.69,34.8 R12.2
$1N5555: length 13.4
  Top Layer w0.254: R11.2 26.36,41.02 25.58,41.8 25.58,45.01 H2.2
$1N5563: length 1.2
  Top Layer w0.254: 32.76,19.36 32.72,19.4 TP1.1
$1N5587: length 3.9
  Top Layer w0.254: USB1.B5 39.19,47.32 37.39,45.52 R28.2
$1N5590: length 3.4
  Top Layer w0.254: R21.2 43.81,45.72 42.19,47.34 USB1.A5
$1N5866: length 3.6
  Top Layer w0.3: 54.23,29.21 54.23,28.58 53.5,27.84 U5.41 ; 54.23,29.21 R23.2
$1N5914: length 4.6
  Top Layer w0.299: 53.06,36.7 52.07,36.7 50.12,34.75 U5.51
$1N6033: length 4.6
  Top Layer w0.3: U5.52 49.62,36.79 50.8,37.97 R26.1
$1N6271: length 5.1
  Top Layer w0.254: 31.68,20.95 35.18,20.95 35.56,21.34 U5.98
$1N6331: length 4.9
  Top Layer w0.254: 31.68,22.35 31.69,22.34 U5.96
$1N6370: length 4.9
  Top Layer w0.254: U5.93 34.89,23.84 34.8,23.75 31.68,23.75
$1N6416: length 5
  Top Layer w0.254: 31.68,25.15 31.98,24.84 U5.91
$1N6457: length 5.1
  Top Layer w0.254: 31.68,26.42 34.54,26.42 35.12,25.84 U5.89
$1N6507: length 5.2
  Top Layer w0.254: 31.68,27.69 34.67,27.69 35.52,26.84 U5.87
$1N6551: length 5.3
  Top Layer w0.254: U5.81 35.81,29.84 34.93,28.96 31.68,28.96
$1N6676: length 5.3
  Top Layer w0.254: U5.79 35.54,30.84 34.87,30.17 31.98,30.17 31.68,30.48
$1N6680: length 5.2
  Top Layer w0.254: U5.78 33.3,31.34 32.64,32 31.68,32
$1N6685: length 5.6
  Top Layer w0.254: U5.77 34.45,31.84 32.77,33.53 31.68,33.53
$1N6938: length 1.8
  Top Layer w0.6: L1.1 50.86,43.08 U3.3
$1N7163: length 6.5
  Top Layer w0.6: R2.2 48.96,48.5 U3.5
  Top Layer w0.635: U3.5 48.96,47.15 47.88,46.06 47.88,44.63 R1.1 47.48,44.23 C1.1

## Copper pours and planes (outline as drawn; the poured copper is in the pictures)
+3V3 on Top Layer: 56.82,24.94 58.34,24.94 58.34,24.18 56.82,24.18
+3V3 on Top Layer: 37.39,17.58 38.91,17.58 38.91,16.82 37.39,16.82
+3V3 on Top Layer: 35.87,34.47 36.63,34.47 36.63,32.94 35.87,32.94
+3V3 on Top Layer: 36.02,34.6 38.18,34.6 38.18,33.07 36.02,33.07
+3V3 on Top Layer: 34.67,20.36 37.34,20.36 37.34,18.88 34.67,18.88
+3V3 on Top Layer: 51.43,34.93 52.58,34.93 52.58,32.39 51.43,32.39
+3V3 on Top Layer: 45.9,38.53 46.66,38.53 46.66,37.01 45.9,37.01
+3V3 on Bottom Layer: 37.39,17.58 38.91,17.58 38.91,16.82 37.39,16.82
+3V3 on Bottom Layer: 35.87,34.47 36.63,34.47 36.63,32.94 35.87,32.94
+3V3 on Bottom Layer: 45.9,38.53 46.66,38.53 46.66,37.01 45.9,37.01
+3V3 on Bottom Layer: 56.82,24.94 58.34,24.94 58.34,24.18 56.82,24.18
+5V on Top Layer: 57.71,11.5 59.23,11.5 59.23,10.73 57.71,10.73
+5V on Top Layer: 52.88,47.55 54.41,47.55 54.41,46.79 52.88,46.79
+5V on Bottom Layer: 57.71,11.5 59.23,11.5 59.23,10.73 57.71,10.73
+5V on Bottom Layer: 52.88,47.55 54.41,47.55 54.41,46.79 52.88,46.79
GND on Top Layer: 0,55.5 98,55.5 98,0 0,0
GND on Bottom Layer: 0,55.5 98,55.5 98,0 0,0

## Text on the board
Bottom Silkscreen Layer: gnd | clk | dio | 3v3 | U_TX | U_RX | tim_clk | tim_trigg | +5v | relay | usb-c | on
Document Layer: h7-uTX | h7-uRX | tim_clk | tim_trigger | https://resources.altium.com/p/routing-requirements-usb-20-2-layer-pcb | usb - / ширина дорожек 16 мил / расстояние между дорожками - 4-5 мил / импеданс нужен 90ом | Существует альтернативный вариант, / который мы не обсуждали: / использование копланарных микрополосковых дифференциальных пар. / Проложив заземляющий слой до / микрополосок на поверхностном слое и / разместив заземляющий слой под / сигнальными линиями на нижнем слое, / можно достичь дифференциального / импеданса 90 Ом при ширине дорожек 9,5 мил, зазоре между дорожками 5 мил и / расстоянии до земли 5 мил. Из приведенных / ниже значений видно, что мы успешно / достигаем требуемого импеданса 90 Ом в / соответствии со спецификацией USB 2.0.
Top Silkscreen Layer: +5v | gnd | clk | dio | 3v3 | U_TX | U_RX | tim_clk | tim_trigg | ctp_int / ctp_sda / stp_scl / lcd_led / lcd_sck / lcd_sdi / lcd_dcx / lcd_reset / lcd_cs / gnd / +5v | boot | reset | relay
